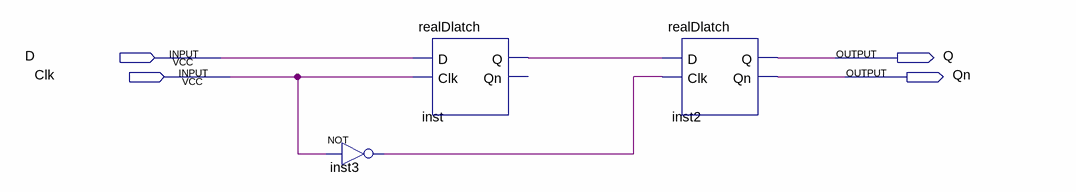
[diagram p0: schematic sheet]
// Quartus schematic step3.bdf as structural Verilog: 3 symbols, 4 pins
module step3 (
  input  D,
  input  Clk,
  output Q,
  output Qn
);

  wire inst3_out, inst_q;

  not inst3 (inst3_out, Clk);
  realDlatch inst (.D(D), .Clk(Clk), .Q(inst_q));  // open: Qn
  realDlatch inst2 (.D(inst_q), .Clk(inst3_out), .Q(Q), .Qn(Qn));
endmodule
